# EasyEDA Pro project GYRO_Test.eprj

# Schematic Schematic1
Board Name: Board1; Create Date: 2025-09-04; Page Name: P1; Project Name: GYRO_Test; Schematic Name: Schematic1; Update Date: 2025-09-04; Company: EasyEDA.com; Page Size: A4; Version: V1.0
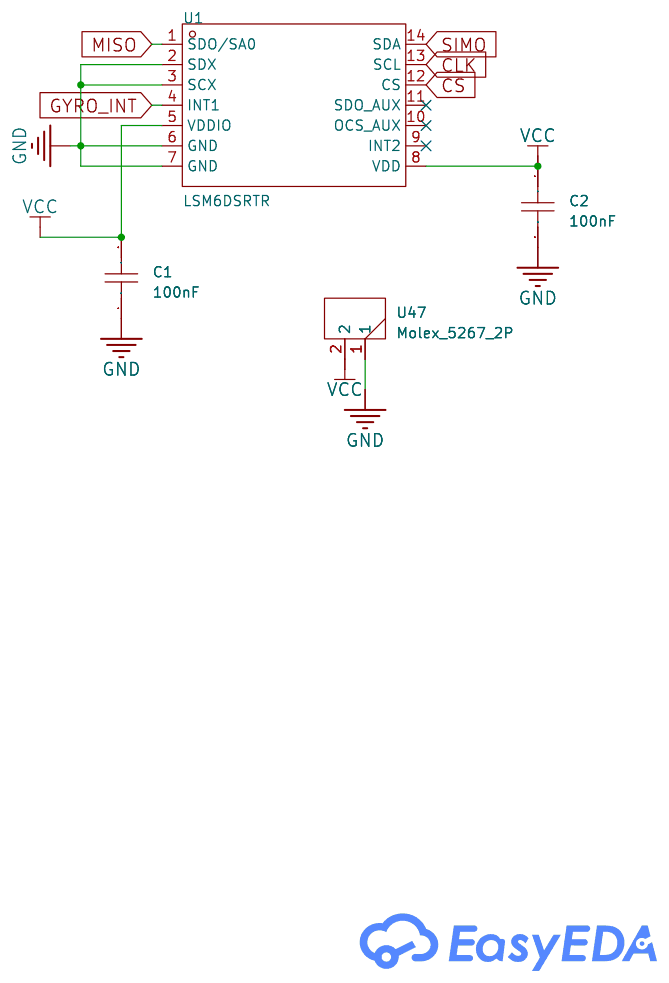
[diagram p0: schematic sheet]

## Parts
C1  100nF  [C0603]
C2  100nF  [C0603]
U1  LSM6DSRTR  [LGA-14_L3.0-W2.5-P0.50-BR]
U47  Molex_5267_2P  [5267_2P]

## Library data of the parts
C1 C2 = CAP_0603: Supplier Footprint: 0603
U1 = LSM6DSRTR: Supplier Part: C784817; Manufacturer: ST(意法半导体); Supplier Footprint: LGA-14(2.5x3); JLCPCB Part Class: Extended Part; Datasheet: https://item.szlcsc.com/datasheet/LSM6DSRTR/840864.html; Supplier: LCSC; Sensor Type: Accelerometer Gyroscope; Operating Temperature: -40℃~+85℃
U47 = Molex_5267_2P

## Nets
GND: C1.1 C2.2 U1.2(SDX) U1.3(SCX) U1.6(GND) U1.7(GND) U47.1
VCC: C1.2 C2.1 U1.5(VDDIO) U1.8(VDD) U47.2
CLK: U1.13(SCL)
CS: U1.12(CS)
GYRO_INT: U1.4(INT1)
MISO: U1.1(SDO/SA0)
SIMO: U1.14(SDA)

Not connected (* = marked no-connect by the designer): U1 9(INT2)* 10(OCS_AUX)* 11(SDO_AUX)*

# Board PCB1
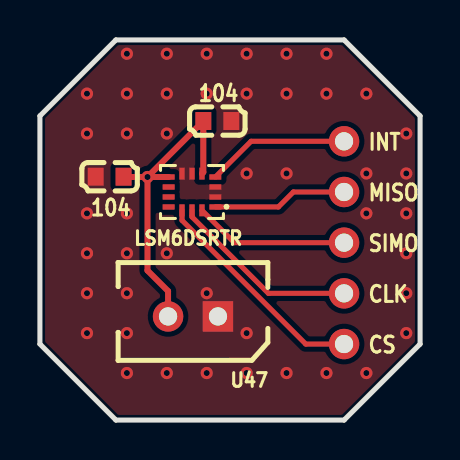
[diagram p1: board, top side]
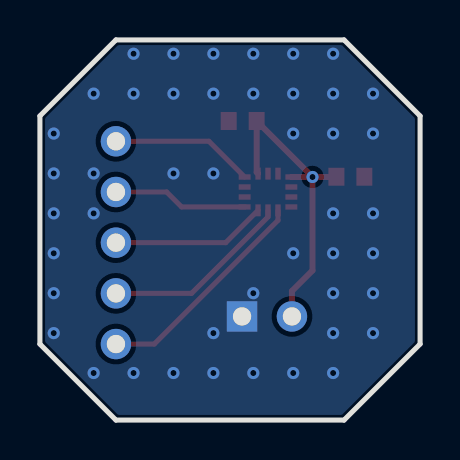
[diagram p2: board, bottom side, seen from below]

Outline 19.05 x 19.05 mm; copper layers: Top Layer, Bottom Layer. Coordinates in mm from the lower left corner of the outline.
Outline path: 0,15.24 0,3.81 3.81,0 15.24,0 19.05,3.81 19.05,15.24 15.24,19.05 3.81,19.05 0,15.24
Stack: Top Layer 0.035mm / Dielectric1 1.51mm FR4 er 4.5 / Bottom Layer 0.035mm

## Design rules (mm)
template: Custom Config
spacing copperThickness1oz (default): track to track 0.102, other pairs 0.152 to 0.3
spacing copperThickness2oz: track to track 0.203, other pairs 0.152 to 0.3
track width copperThickness1oz (default): min 0.127, default 0.254, max 2.54
track width copperThickness2oz: min 0.203, default 0.254, max 2.54
differential pair differentialPair (default): width min 0.127, default 0.254, max 2.54; gap min 0.152, default 0.152
via viaSize (default): diameter min 0.5, default 0.61, max 10; hole min 0.3, default 0.305, max 6.3

## Placement (name value [footprint] x y rotation side)
C1  100nF  [C0603]  8.89 14.99 180 top
C2  100nF  [C0603]  3.49 12.19 180 top
LSM6DSRTR  LSM6DSRTR  [LGA-14_L3.0-W2.5-P0.50-BR]  7.62 11.43 0 top
NOREF  -  [Pad_e18]  15.24 13.97 0 top
NOREF#2  -  [Pad_e20]  15.24 8.89 0 top
NOREF#3  -  [Pad_e19]  15.24 11.43 0 top
NOREF#4  -  [Pad_e21]  15.24 6.35 0 top
NOREF#5  -  [Pad_e22]  15.24 3.81 0 top
U47  Molex_5267_2P  [5267_2P]  8.92 5.19 180 top

## Footprints (pads in the part's own frame, mm; a bottom-side part is the same pattern mirrored in y, then rotated)
5267_2P
  rect 1.524x1.524 hole 0.914: 1(0,0)
  round 1.524 hole 0.914: 2(2.5,0)
C0603
  rect 0.8x0.9 smd: 1(-0.7,0) 2(0.7,0)
LGA-14_L3.0-W2.5-P0.50-BR
  rect 0.6x0.27 smd: 1(1.17,-0.75) 2(1.17,-0.25) 3(1.17,0.25) 4(1.17,0.75) 8(-1.17,0.75) 9(-1.17,0.25) 10(-1.17,-0.25) 11(-1.17,-0.75)
  rect 0.27x0.6 smd: 5(0.5,0.92) 6(0,0.92) 7(-0.5,0.92) 12(-0.5,-0.92) 13(0,-0.92) 14(0.5,-0.92)
Pad_e18
  round 1.524 hole 0.914: 1(0,0)
Pad_e19
  round 1.524 hole 0.914: 2(0,0)
Pad_e20
  round 1.524 hole 0.914: 3(0,0)
Pad_e21
  round 1.524 hole 0.914: 4(0,0)
Pad_e22
  round 1.524 hole 0.914: 5(0,0)

## Nets
GND: C1.1 C2.2 LSM6DSRTR.2 LSM6DSRTR.3 LSM6DSRTR.6 LSM6DSRTR.7 U47.1
VCC: C1.2 C2.1 LSM6DSRTR.5 LSM6DSRTR.8 U47.2
CLK: LSM6DSRTR.13 NOREF#4.4
CS: LSM6DSRTR.12 NOREF#5.5
GYRO_INT: LSM6DSRTR.4 NOREF.1
MISO: LSM6DSRTR.1 NOREF#3.2
SIMO: LSM6DSRTR.14 NOREF#2.3

Pads without a net: LSM6DSRTR 9 10 11

## Via types
v1: diameter 0.61, hole 0.305, Top Layer to Bottom Layer, 46 vias

## Routing (per net, layer and track width the routed paths; a pad name or vN(x,y) marks a point on that pad's centre or on a via; arc(x,y) is an arc through that point)
GND:
  vias: v1(2.36,16.36) v1(2.36,14.36) v1(2.36,10.36) v1(2.36,8.36) v1(2.36,6.36) v1(2.36,4.36) v1(4.36,18.36) v1(4.36,16.36) v1(4.36,14.36) v1(4.36,10.36) v1(4.36,8.36) v1(4.36,6.36) v1(4.36,4.36) v1(4.36,2.36) v1(6.36,18.36) v1(6.36,16.36) v1(6.36,14.36) v1(6.36,8.36) v1(6.36,2.36) v1(8.36,18.36) v1(8.36,16.36) v1(8.36,6.36) v1(8.36,2.36) v1(10.36,18.36) v1(10.36,16.36) v1(10.36,12.36) v1(10.36,4.36) v1(10.36,2.36) v1(12.36,18.36) v1(12.36,16.36) v1(12.36,12.36) v1(12.36,2.36) v1(14.36,18.36) v1(14.36,16.36) v1(14.36,2.36) v1(16.36,16.36) v1(16.36,12.36) v1(16.36,10.36) v1(16.36,2.36) v1(18.36,14.36) v1(18.36,12.36) v1(18.36,10.36) v1(18.36,8.36) v1(18.36,6.36) v1(18.36,4.36)
VCC: length 16.3
  Top Layer w0.3: U47.2 6.42,6.46 5.39,7.49 v1(5.39,12.18) ; v1(5.39,12.18) 4.21,12.18 C2.1 ; v1(5.39,12.18) LSM6DSRTR.8 ; v1(5.39,12.18) 5.39,12.19 8.19,14.98 ; LSM6DSRTR.5 8.19,12.42 8.19,14.98 ; 8.19,14.98 C1.2
CLK: length 9.5
  Top Layer w0.254: LSM6DSRTR.13 7.62,10.18 11.45,6.35 NOREF#4.4
CS: length 11.2
  Top Layer w0.254: NOREF#5.5 13.32,3.81 7.12,10.01 LSM6DSRTR.12
GYRO_INT: length 7.2
  Top Layer w0.254: LSM6DSRTR.4 10.58,13.97 NOREF.1
MISO: length 6.8
  Top Layer w0.254: LSM6DSRTR.1 11.95,10.68 12.7,11.43 NOREF#3.2
SIMO: length 7.8
  Top Layer w0.254: LSM6DSRTR.14 9.74,8.89 NOREF#2.3

## Copper pours and planes (outline as drawn; the poured copper is in the pictures)
GND on Top Layer: -3.35,22.83 22.05,22.83 22.05,-3.84 -3.35,-3.84
GND on Bottom Layer: -4.62,24.1 23.32,24.1 23.32,-5.11 -4.62,-5.11

## Text on the board
Top Silkscreen Layer: 104 | INT | MISO | SIMO | CLK | CS
